# Altium project TrackerController.PrjPcb
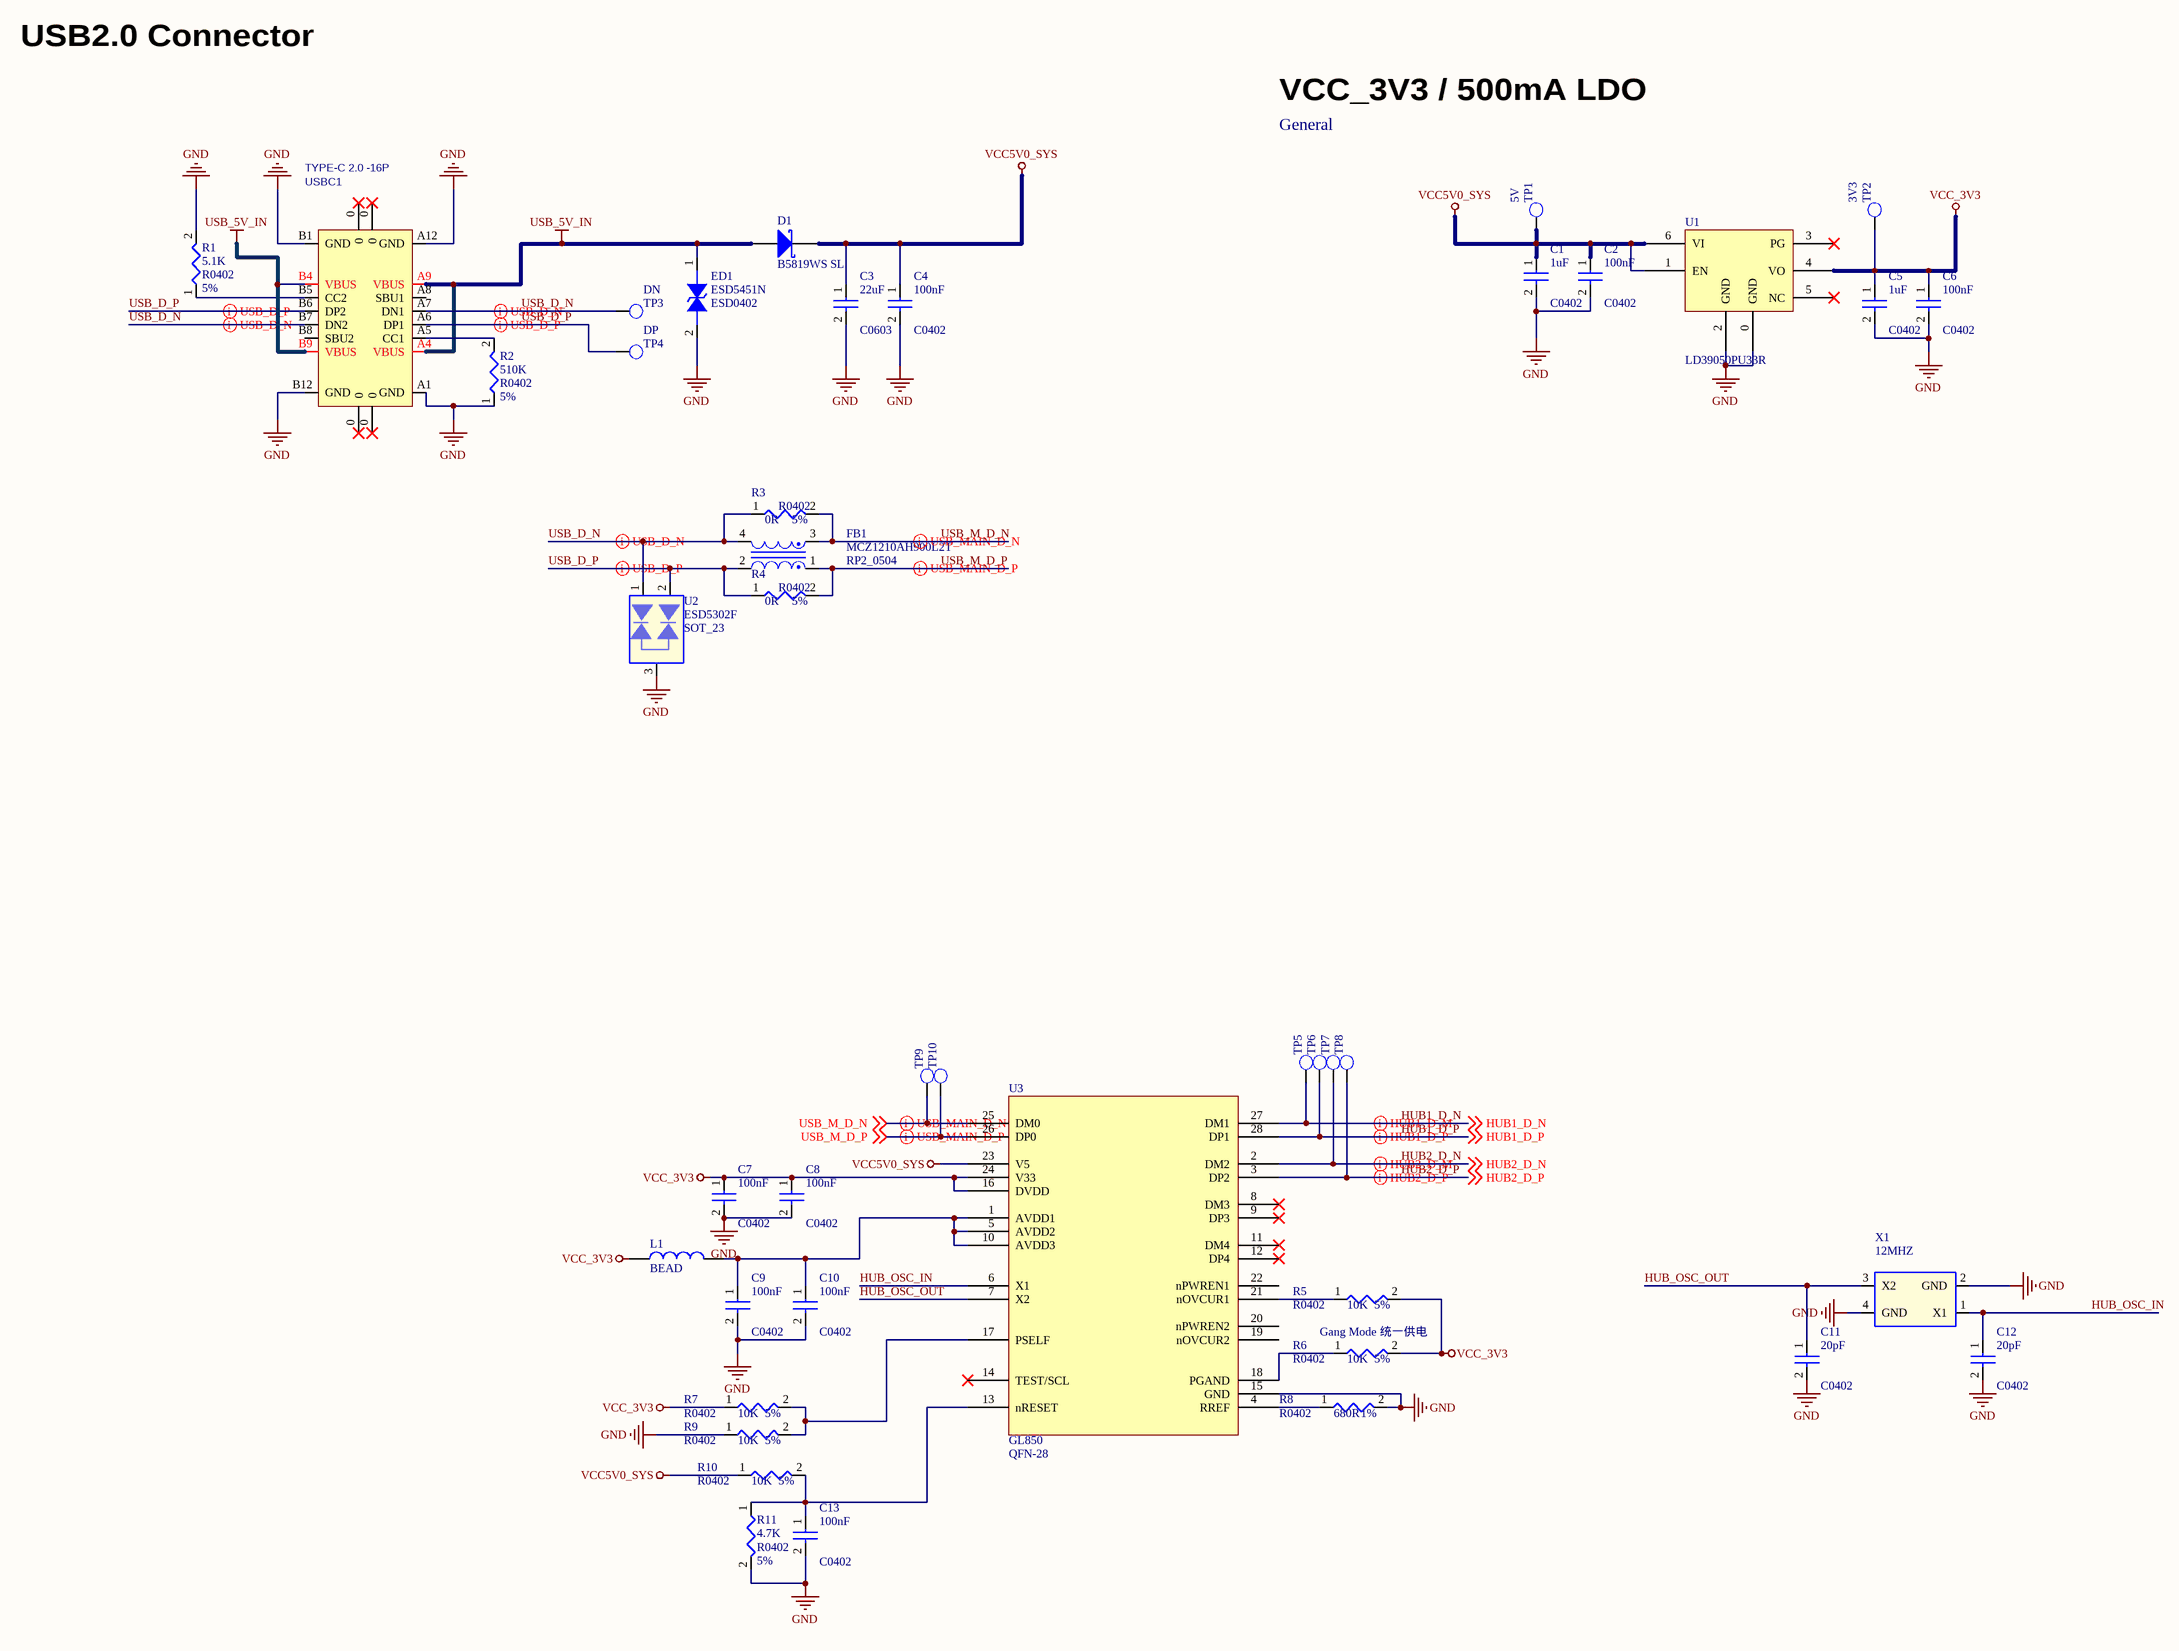
[diagram p0: 1.SchDoc]
3 sheets, 110 parts. Net scope: global (net labels, ports and power ports of the same name join across sheets).
Board file: tracker_controller.PcbDoc
Sheets:
  1.SchDoc
  2.SchDoc
  3.SchDoc

## Sheet 1.SchDoc
size C

### Parts
C1  1uF  PCB Footprint: C0402  [C0402_L]
C2  100nF  PCB Footprint: C0402  [C0402_L]
C3  22uF  PCB Footprint: C0603  [C0603_L]
C4  100nF  PCB Footprint: C0402  [C0402_L]
C5  1uF  PCB Footprint: C0402  [C0402_L]
C6  100nF  PCB Footprint: C0402  [C0402_L]
C7  100nF  PCB Footprint: C0402  [C0402_L]
C8  100nF  PCB Footprint: C0402  [C0402_L]
C9  100nF  PCB Footprint: C0402  [C0402_L]
C10  100nF  PCB Footprint: C0402  [C0402_L]
C11  20pF  PCB Footprint: C0402  [C0402_L]
C12  20pF  PCB Footprint: C0402  [C0402_L]
C13  100nF  PCB Footprint: C0402  [C0402_L]
D1  B5819WS SL  [SOD-323]
ED1  ESD5451N  [ESD0402]
FB1  MCZ1210AH900L2T  PCB Footprint: RP2_0504  [L0402D]  (net tie, no BOM)
L1  BEAD  [L0402]
R1  5.1K  Tolerance: 5%  [R0402]
R2  510K  Tolerance: 5%  [R0402]
R3  0R  Tolerance: 5%  [R0402]
R4  0R  Tolerance: 5%  [R0402]
R5  10K  Tolerance: 5%  [R0402]
R6  10K  Tolerance: 5%  [R0402]
R7  10K  Tolerance: 5%  [R0402]
R8  680R  Tolerance: 1%  [R0402]
R9  10K  Tolerance: 5%  [R0402]
R10  10K  Tolerance: 5%  [R0402]
R11  4.7K  Tolerance: 5%  [R0402]
TP1  5V  [TP_0R70]  (no BOM)
TP2  3V3  [TP_0R70]  (no BOM)
TP3  DN  [TP_0R70]  (no BOM)
TP4  DP  [TP_0R70]  (no BOM)
TP5  (no value)  [TP_0R70]  (no BOM)
TP6  (no value)  [TP_0R70]  (no BOM)
TP7  (no value)  [TP_0R70]  (no BOM)
TP8  (no value)  [TP_0R70]  (no BOM)
TP9  (no value)  [TP_0R70]  (no BOM)
TP10  (no value)  [TP_0R70]  (no BOM)
U1  LD39050PU33R  [SON95P300X300X100-7N]
U2  ESD5302F  PCB Footprint: SOT_23  [SOT23]
U3  GL850  [QFN-28]
USBC1  TYPE-C 2.0 -16P  [USB-C-SMD_16P]
X1  12MHZ  [XTAL_3225]

### Nets
GND: C1.2 C2.2 C3.2 C4.2 C5.2 C6.2 C7.2 C8.2 C9.2 C10.2 C11.2 C12.2 C13.2 ED1.2 R1.2 R2.1 R8.2 R9.1 R11.2 U1.0(GND) U1.2(GND) U2.3 U3.15(GND) USBC1.A1(GND) USBC1.A12(GND) USBC1.B1(GND) USBC1.B12(GND) X1.2(GND) X1.4(GND)  [project net AGND]
USB_5V_IN: D1.1(A) ED1.1 USBC1.A4(VBUS) USBC1.A9(VBUS) USBC1.B4(VBUS) USBC1.B9(VBUS)
VCC5V0_SYS: C1.1 C2.1 C3.1 C4.1 D1.2(K) R10.1 TP1.1 U1.1(EN) U1.6(VI) U3.23(V5)
VCC_3V3: C5.1 C6.1 C7.1 C8.1 L1.1 R5.2 R6.2 R7.1 TP2.1 U1.4(VO) U3.16(DVDD) U3.24(V33)
HUB1_D_N: TP5.1 U3.27(DM1) ; off-sheet HUB1_D_N
HUB1_D_P: TP6.1 U3.28(DP1) ; off-sheet HUB1_D_P
HUB2_D_N: TP7.1 U3.2(DM2) ; off-sheet HUB2_D_N
HUB2_D_P: TP8.1 U3.3(DP2) ; off-sheet HUB2_D_P
HUB_OSC_IN: C12.1 U3.6(X1) X1.1(X1)
HUB_OSC_OUT: C11.1 U3.7(X2) X1.3(X2)
USB_D_N: FB1.4 R3.1 TP3.1 U2.1 USBC1.A7(DN1) USBC1.B7(DN2)
USB_D_P: FB1.2 R4.1 TP4.1 U2.2 USBC1.A6(DP1) USBC1.B6(DP2)
USB_M_D_N: FB1.3 R3.2 TP9.1 U3.25(DM0) ; off-sheet USB_M_D_N
USB_M_D_P: FB1.1 R4.2 TP10.1 U3.26(DP0) ; off-sheet USB_M_D_P
NetC9_1: C9.1 C10.1 L1.2 U3.1(AVDD1) U3.5(AVDD2) U3.10(AVDD3)
NetC13_1: C13.1 R10.2 R11.1 U3.13(nRESET)
NetR1_1: R1.1 USBC1.B5(CC2)
NetR2_2: R2.2 USBC1.A5(CC1)
NetR5_1: R5.1 U3.21(nOVCUR1)
NetR6_1: R6.1 U3.18(PGAND)
NetR7_2: R7.2 R9.2 U3.17(PSELF)
NetR8_1: R8.1 U3.4(RREF)

Not connected (* = marked no-connect by the designer): U1 3(PG)* 5(NC)*; U3 8(DM3)* 9(DP3)* 11(DM4)* 12(DP4)* 14(TEST/SCL)* 19(nOVCUR2) 20(nPWREN2) 22(nPWREN1); USBC1 0* A8(SBU1) B8(SBU2)

### Layout directives
differential pair; differential pair class USB: HUB1_D_N, HUB1_D_P, HUB2_D_N, HUB2_D_P, USB_D_N, USB_D_P, USB_M_D_N, USB_M_D_P
differential pair; differential pair class USB; net class USB: USB_D_N, USB_D_P

### Notes on the sheet
- USB2.0 Connector
- VCC_3V3 / 500mA LDO
- General
- (near R6) Gang Mode 统一供电

### Library data of the parts
C1 C5 = CAP NP_Dup1: cap,1.0uF,+/-10%,6.3V,X5R,C0402; Manufacturer_Name: Open/Any; Priority: A; Part Type: Capacitor; Package: 0402; Manufacturer_Part_Number: Open/Any
C2 C6 = CAP NP_Dup1: cap,1.0uF,+/-10%,6.3V,C0402; Manufacturer_Name: Open/Any; Priority: A; Part Type: Capacitor; Package: 0402; Manufacturer_Part_Number: Open/Any
C3 = CAP NP_Dup1: cap,22.00uF,+/-10%,10V,X5R,C0603; Manufacturer_Name: Open/Any; Priority: A; Part Type: Capacitor; Package: 0603; Manufacturer_Part_Number: Open/Any
C4 C7-C10 C13 = CAP NP_Dup1: cap,100.00nF,+/-10%,10V,X5R,C0402; Manufacturer_Name: Open/Any; Priority: A; Part Type: Capacitor; Package: 0402; Manufacturer_Part_Number: Open/Any
C11 C12 = CAP NP_Dup1: cap,20pF,+/-10%,25V,X5R,C0402; Manufacturer_Name: Open/Any; Priority: A; Part Type: Capacitor; Package: 0402; Manufacturer_Part_Number: Open/Any
D1 = SS14: B5819WS SL 肖特基二极管 / SOD-323; Manufacturer_Name: MDD; Part Type: Diode; Package: SOD-323; Manufacturer_Part_Number: B5819WS SL
ED1 = DIODE BI_DIR TRIG: 1-Line, Bi-directional, Transient Voltage Suppressors.17.5pF.; Manufacturer_Name: Will Semiconductor Ltd.; Priority: A; PCB Footprint: ESD0402; Part Type: ESD_TVS; Manufacturer_Part_Number: ESD5451N; Package: 0402
FB1 = INDUCTOR COM: MCZ1210AH900L2T, 0603 90Ohm 100MHz; Manufacturer_Name: TDK; Priority: A; Part Type: BEAD; Manufacturer_Part_Number: MCZ1210AH900L2T; Package: 0504
L1 = L-AL: 鐵氧體磁珠 33ohm 0.55A 550mOhms 0402 Chip Bead; Manufacturer_Name: TDK; Manufacturer_Part_Number: MPZ0402S330CTF0W; PCB Footprint: 0402; Part Type: BEAD; Package: 0402
R1 = RESISTOR: 通用厚膜电阻,5.1K,+/-5%,R0402; Manufacturer_Name: Open/Any; Priority: A; PCB Footprint: R0402; Part Type: Resistor; Package: 0402; Manufacturer_Part_Number: Open/Any
R2 = RESISTOR: 通用厚膜电阻,510K,+/-1%,R0402; Manufacturer_Name: Open/Any; Priority: A; PCB Footprint: R0402; Part Type: Resistor; Package: 0402; Manufacturer_Part_Number: Open/Any
R3 R4 = RESISTOR: 通用厚膜电阻,0R,+/-5%,R0402; Manufacturer_Name: Open/Any; Priority: A; PCB Footprint: R0402; Part Type: Resistor; Package: 0402; Manufacturer_Part_Number: Open/Any
R5-R7 R9 R10 = RESISTOR: 通用厚膜电阻,10K,+/-5%,R0402; Manufacturer_Name: Open/Any; Priority: A; PCB Footprint: R0402; Part Type: Resistor; Package: 0402; Manufacturer_Part_Number: Open/Any
R8 = RESISTOR: 通用厚膜电阻,680R,+/-1%,R0402; Manufacturer_Name: Open/Any; Priority: A; PCB Footprint: R0402; Part Type: Resistor; Package: 0402; Manufacturer_Part_Number: Open/Any
R11 = RESISTOR: 通用厚膜电阻,4.7K,+/-5%,R0402; Manufacturer_Name: Open/Any; Priority: A; PCB Footprint: R0402; Part Type: Resistor; Package: 0402; Manufacturer_Part_Number: Open/Any
TP1-TP10 = TP: Test Point 0.7mm; PCB Footprint: TP_0R50; Priority: A; Part Type: TP
U1 = LD39050PU33R: LD39050PU33R / 6-DFN (3x3) / Output 500mA; Manufacturer_Name: STMicroelectronics; PCB Footprint: DFN-6; Manufacturer_Part_Number: LD39050PU33R; Package: DFN-6; Part Type: LDO
U2 = ESD_ESDA6V8UL: 2-Lines, Uni-directional,Ultra-low Capacitance.Transient Voltage Suppressors; Manufacturer_Name: Will Semiconductor Ltd.; Priority: A; Part Type: ESD_TVS; Manufacturer_Part_Number: ESD5302F; Package: SOT-23
U3 = GL850G: GL850 4 Port USB HUB QFN-28; Manufacturer_Name: Genesys Logic, Inc.; Manufacturer_Part_Number: GL850G-OHYXX; Package: QFN-28; Part Type: IC; PCB Footprint: QFN-28
USBC1 = USB2.0_Type-C_16Pin: USB2.0_Type-C_16Pin母座; Manufacturer_Name: SUNFUN/ Global Connector Technology; Manufacturer_Part_Number: MCCF-R1N1/USB4105-15-A-120; Part Type: USB Connector
X1 = CRYSTAL_4P: 12MHZ (16pF), 3.2 mm x 2.5 mm / 无源晶振(谐振器）; Manufacturer_Name: Open/Any; Manufacturer_Part_Number: Open/Any

## Sheet 2.SchDoc
size B
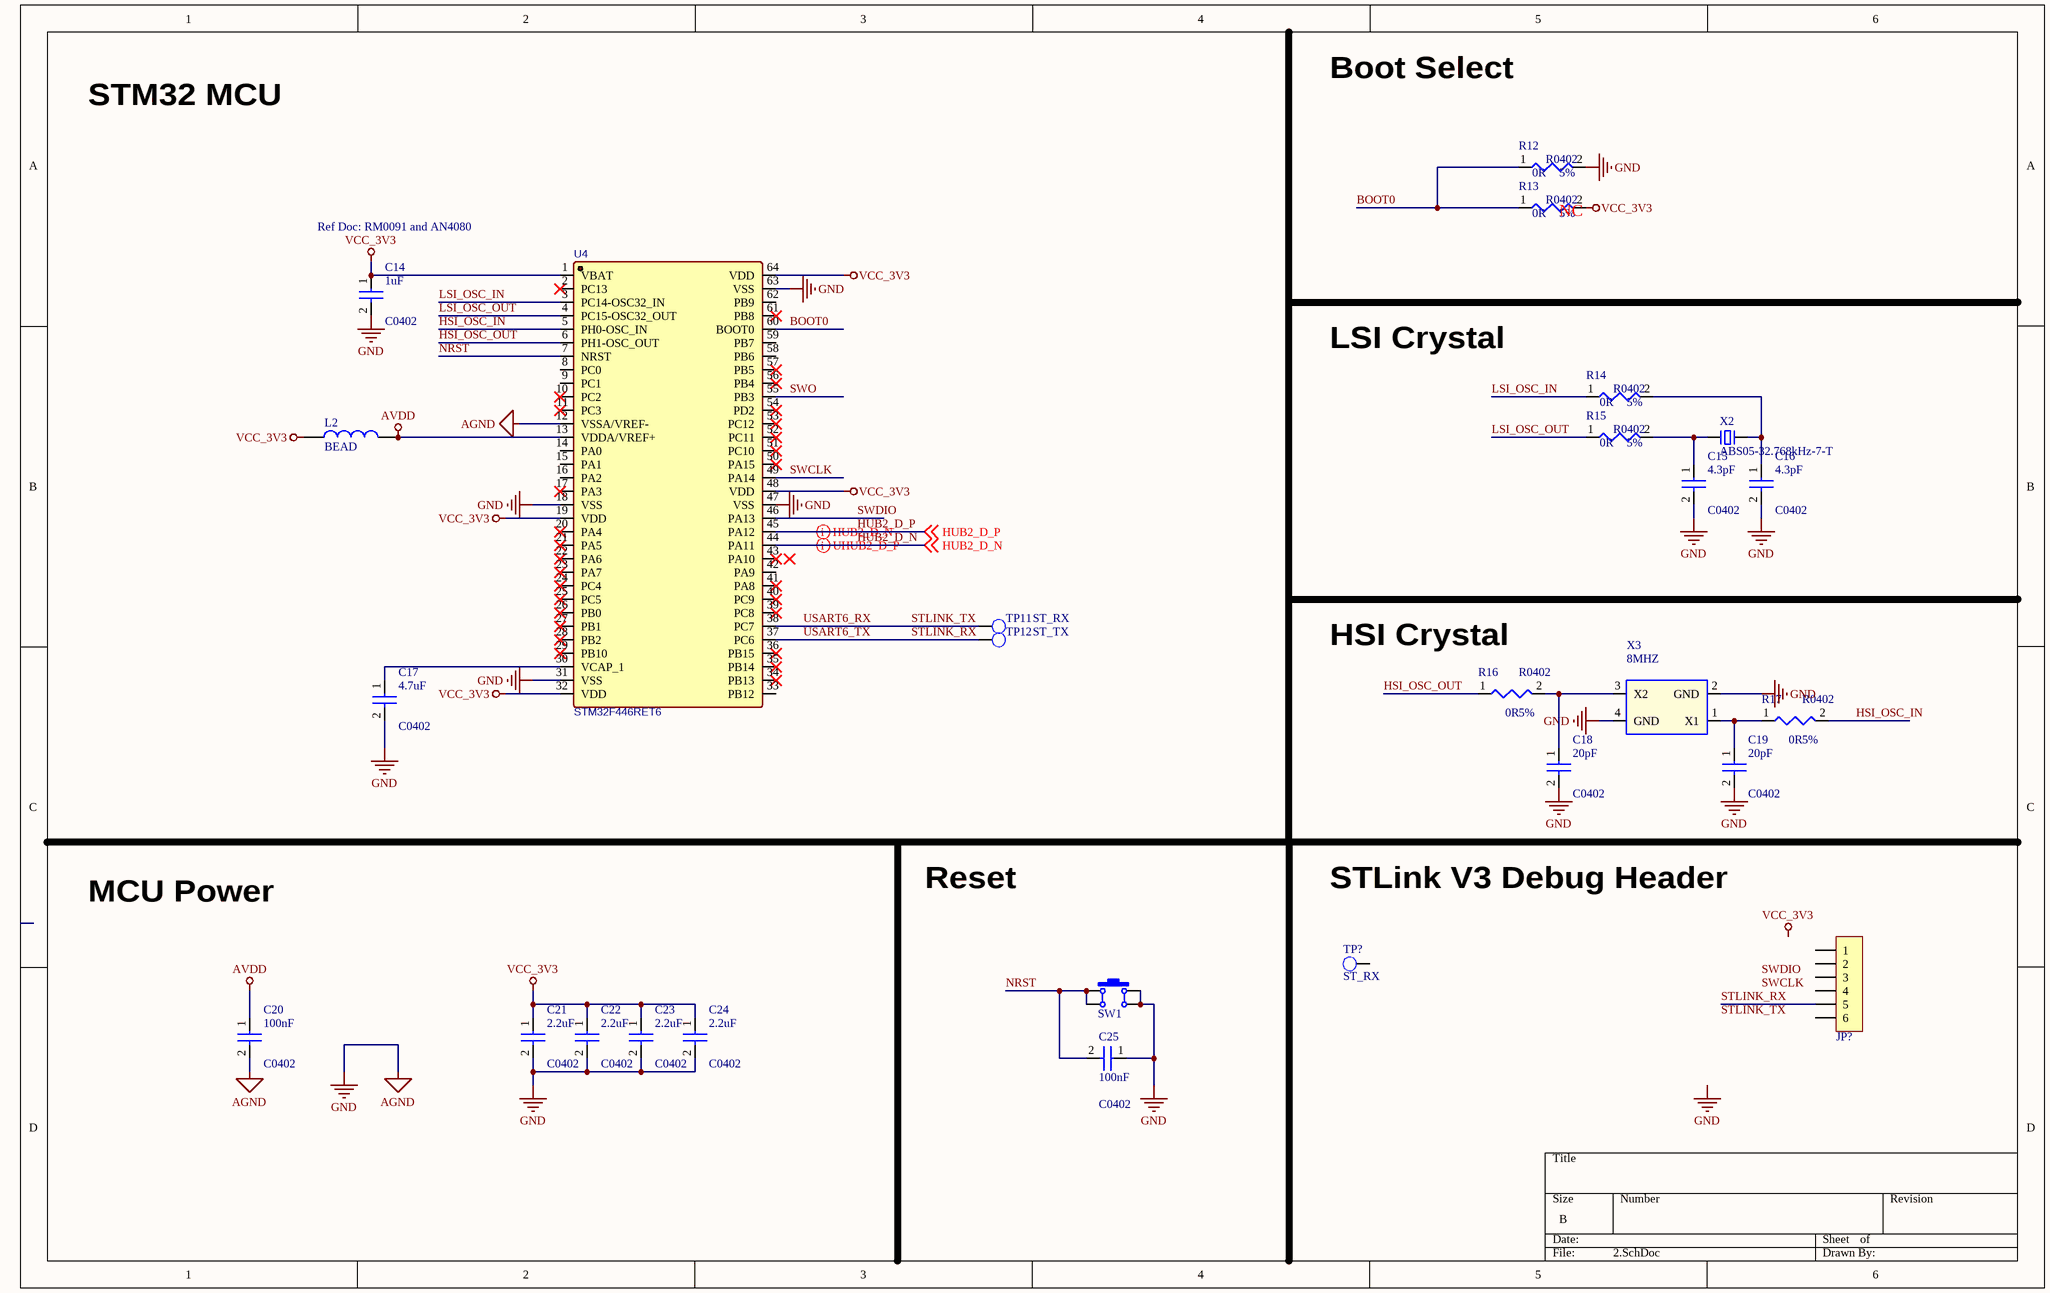
[diagram p1: 2.SchDoc]

### Parts
C14  1uF  PCB Footprint: C0402  [C0402_L]
C15  4.3pF  PCB Footprint: C0402  [C0402_L]
C16  4.3pF  PCB Footprint: C0402  [C0402_L]
C17  4.7uF  PCB Footprint: C0402  [C0402_L]
C18  20pF  PCB Footprint: C0402  [C0402_L]
C19  20pF  PCB Footprint: C0402  [C0402_L]
C20  100nF  PCB Footprint: C0402  [C0402_L]
C21  2.2uF  PCB Footprint: C0402  [C0402_L]
C22  2.2uF  PCB Footprint: C0402  [C0402_L]
C23  2.2uF  PCB Footprint: C0402  [C0402_L]
C24  2.2uF  PCB Footprint: C0402  [C0402_L]
C25  100nF  PCB Footprint: C0402  [C0402_L]
JP?  HDR-1X6  [HDR2.0-M-LI-6P]  (value not drawn)
L2  BEAD  [L0402]
R12  0R  Tolerance: 5%  [R0402]
R13  0R  Tolerance: 5%  [R0402]  (net tie, no BOM)
R14  0R  Tolerance: 5%  [R0402]
R15  0R  Tolerance: 5%  [R0402]
R16  0R  Tolerance: 5%  [R0402]
R17  0R  Tolerance: 5%  [R0402]
SW1  6x6x1.5  [TSW SMD-6*6*5]  (value not drawn)
TP11  ST_RX  [TP_0R70]  (no BOM)
TP12  ST_TX  [TP_0R70]  (no BOM)
TP?  ST_RX  [TP_0R70]  (no BOM)
U4  STM32F446RET6  [LQFP64_L]
X2  ABS05-32.768kHz-7-T  [XTAL_3215]
X3  8MHZ  [XTAL_3225]

### Nets
AGND: C14.2 C15.2 C16.2 C17.2 C18.2 C19.2 C20.2 C21.2 C22.2 C23.2 C24.2 C25.1 R12.2 SW1.2 SW1.3 U4.12(VSSA/VREF-) U4.18(VSS) U4.31(VSS) U4.47(VSS) U4.63(VSS) X3.2(GND) X3.4(GND)  [also labelled GND]
AVDD: C20.1 L2.2 U4.13(VDDA/VREF+)
VCC_3V3: C14.1 C21.1 C22.1 C23.1 C24.1 L2.1 R13.2 U4.1(VBAT) U4.19(VDD) U4.32(VDD) U4.48(VDD) U4.64(VDD)
BOOT0: R12.1 R13.1 U4.60(BOOT0)
HSI_OSC_IN: R17.2 U4.5(PH0-OSC_IN)
HSI_OSC_OUT: R16.1 U4.6(PH1-OSC_OUT)
HUB2_D_N: U4.44(PA11) ; off-sheet HUB2_D_N
HUB2_D_P: U4.45(PA12) ; off-sheet HUB2_D_P
LSI_OSC_IN: R14.1 U4.3(PC14-OSC32_IN)
LSI_OSC_OUT: R15.1 U4.4(PC15-OSC32_OUT)
NRST: C25.2 SW1.1 SW1.4 U4.7(NRST)
STLINK_RX: JP?.5 TP12.1 U4.37(PC6)  [also labelled USART6_TX]
STLINK_TX: TP11.1 U4.38(PC7)  [also labelled USART6_RX]
SWCLK: U4.49(PA14)
SWDIO: U4.46(PA13)
SWO: U4.55(PB3)
NetC15_1: C15.1 R15.2 X2.1
NetC16_1: C16.1 R14.2 X2.2
NetC17_1: C17.1 U4.30(VCAP_1)
NetC18_1: C18.1 R16.2 X3.3(X2)
NetC19_1: C19.1 R17.1 X3.1(X1)

Not connected (* = marked no-connect by the designer): JP? 1 2 3 4 6; TP? 1; U4 2(PC13)* 8(PC0) 9(PC1) 10(PC2)* 11(PC3)* 14(PA0) 15(PA1) 16(PA2) 17(PA3)* 20(PA4)* 21(PA5)* 22(PA6)* 23(PA7)* 24(PC4)* 25(PC5)* 26(PB0)* 27(PB1)* 28(PB2)* 29(PB10)* 33(PB12) 34(PB13)* 35(PB14)* 36(PB15)* 39(PC8)* 40(PC9)* 41(PA8)* 42(PA9) 43(PA10)* 50(PA15)* 51(PC10)* 52(PC11)* 53(PC12)* 54(PD2)* 56(PB4)* 57(PB5)* 58(PB6) 59(PB7) 61(PB8)* 62(PB9)

### Layout directives
differential pair; differential pair class USB: HUB2_D_N, HUB2_D_P

### Notes on the sheet
- Boot Select
- STM32 MCU
- Ref Doc: RM0091 and AN4080
- (near R13) NC
- LSI Crystal
- (near R16) HSI Crystal
- MCU Power
- Reset
- STLink V3 Debug Header
- Labels drawn without touching a wire or pin: GND, SWCLK, SWDIO, VCC_3V3

### Library data of the parts
C14 = CAP NP_Dup1: cap,1.00uF,+/-10%,10V,X5R,C0402; Manufacturer_Name: Open/Any; Priority: A; Part Type: Capacitor; Package: 0402; Manufacturer_Part_Number: Open/Any
C15 C16 = CAP NP_Dup1: cap,4.3pF,+/-10%,25V,X5R,C0402; Manufacturer_Name: Open/Any; Priority: A; Part Type: Capacitor; Package: 0402; Manufacturer_Part_Number: Open/Any
C17 = CAP NP_Dup1: cap,4.70uF,+/-10%,6.3V,X5R,C0402; Manufacturer_Name: Open/Any; Priority: A; Part Type: Capacitor; Package: 0402; Manufacturer_Part_Number: Open/Any
C18 C19 = CAP NP_Dup1: as C11 on sheet 1; Part Type: Capacitor; Package: 0402; Manufacturer_Part_Number: Open/Any
C20 C25 = CAP NP_Dup1: as C4 on sheet 1; Part Type: Capacitor; Package: 0402; Manufacturer_Part_Number: Open/Any
C21-C24 = CAP NP_Dup1: cap,2.20uF,+/-10%,10V,X5R,C0402; Manufacturer_Name: Open/Any; Priority: A; Part Type: Capacitor; Package: 0402; Manufacturer_Part_Number: Open/Any
JP? = Header 6: 6P接插件; 封装库来自淘宝卖家 ID：黄晶宝石: https://shop463601444.taobao.com
L2 = L-AL: as L1 on sheet 1; Part Type: BEAD; Package: 0402
R12-R17 = RESISTOR: as R3 on sheet 1; PCB Footprint: R0402; Part Type: Resistor; Package: 0402; Manufacturer_Part_Number: Open/Any
SW1 = SW SMD-4x4: 贴片6x6x1.5 轻触开关; Part Type: Mount Hole
TP11 TP12 TP? = TP: as TP1 on sheet 1; Part Type: TP
U4 = STM32F446RET6: Manufacturer_Name: STMicroelectronics; PCB Footprint: LQFP64; Package: LQFP64; Part Type: Microcontroller; Manufacturer_Part_Number: STM32F446RE
X2 = XTAL-2P: ABS05-32.768kHz-7-T / 3215 2脚无源晶振(谐振器）; Manufacturer_Name: Open/Any; Manufacturer_Part_Number: Open/Any
X3 = CRYSTAL_4P: 8MHZ (16pF), 3.2 mm x 2.5 mm / 无源晶振(谐振器）; Manufacturer_Name: Open/Any; Manufacturer_Part_Number: Open/Any

## Sheet 3.SchDoc
size A
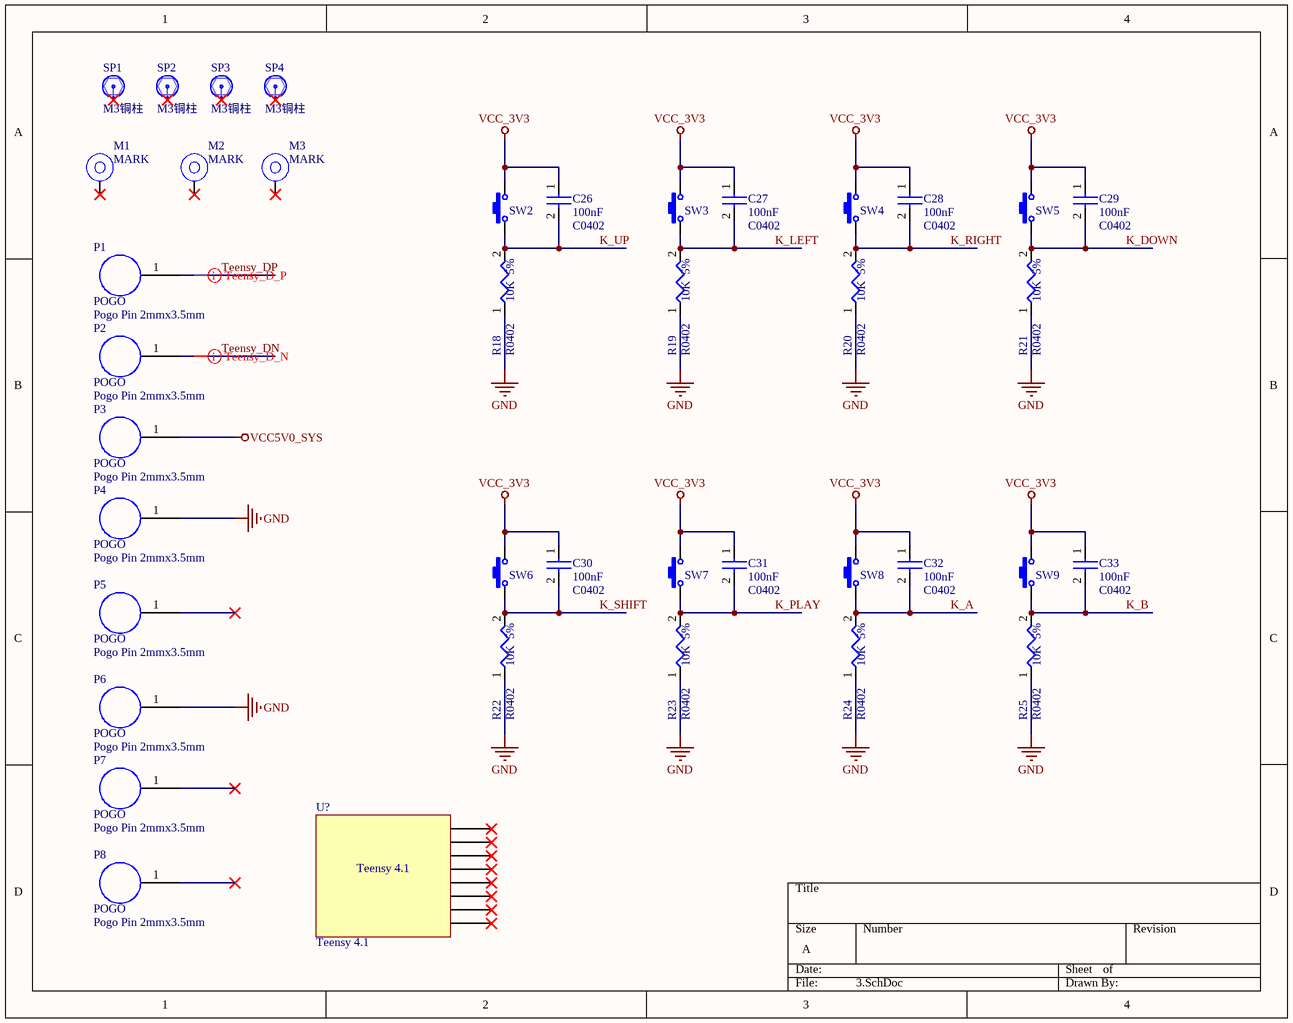
[diagram p2: 3.SchDoc]

### Parts
C26  100nF  PCB Footprint: C0402  [C0402_L]
C27  100nF  PCB Footprint: C0402  [C0402_L]
C28  100nF  PCB Footprint: C0402  [C0402_L]
C29  100nF  PCB Footprint: C0402  [C0402_L]
C30  100nF  PCB Footprint: C0402  [C0402_L]
C31  100nF  PCB Footprint: C0402  [C0402_L]
C32  100nF  PCB Footprint: C0402  [C0402_L]
C33  100nF  PCB Footprint: C0402  [C0402_L]
M1  MARK  [MARK]  (net tie, no BOM)
M2  MARK  [MARK]  (net tie, no BOM)
M3  MARK  [MARK]  (net tie, no BOM)
P1  Pogo Pin 2mmx3.5mm  [Pogo_2x3.5]
P2  Pogo Pin 2mmx3.5mm  [Pogo_2x3.5]
P3  Pogo Pin 2mmx3.5mm  [Pogo_2x3.5]
P4  Pogo Pin 2mmx3.5mm  [Pogo_2x3.5]
P5  Pogo Pin 2mmx3.5mm  [Pogo_2x3.5]
P6  Pogo Pin 2mmx3.5mm  [Pogo_2x3.5]
P7  Pogo Pin 2mmx3.5mm  [Pogo_2x3.5]
P8  Pogo Pin 2mmx3.5mm  [Pogo_2x3.5]
R18  10K  Tolerance: 5%  [R0402]
R19  10K  Tolerance: 5%  [R0402]
R20  10K  Tolerance: 5%  [R0402]
R21  10K  Tolerance: 5%  [R0402]
R22  10K  Tolerance: 5%  [R0402]
R23  10K  Tolerance: 5%  [R0402]
R24  10K  Tolerance: 5%  [R0402]
R25  10K  Tolerance: 5%  [R0402]
SP1  M3铜柱  [M3x4_N]  (net tie, no BOM)
SP2  M3铜柱  [M3x4_N]  (net tie, no BOM)
SP3  M3铜柱  [M3x4_N]  (net tie, no BOM)
SP4  M3铜柱  [M3x4_N]  (net tie, no BOM)
SW2  3x6x5  [Kailh_socket_PG1350]  (value not drawn)
SW3  3x6x5  [Kailh_socket_PG1350]  (value not drawn)
SW4  3x6x5  [Kailh_socket_PG1350]  (value not drawn)
SW5  3x6x5  [Kailh_socket_PG1350]  (value not drawn)
SW6  3x6x5  [Kailh_socket_PG1350]  (value not drawn)
SW7  3x6x5  [Kailh_socket_PG1350]  (value not drawn)
SW8  3x6x5  [Kailh_socket_PG1350]  (value not drawn)
SW9  3x6x5  [Kailh_socket_PG1350]  (value not drawn)
U?  Teensy 4.1  [Teensy_Mech]  (net tie)

### Nets
GND: P4.1 P6.1 R18.1 R19.1 R20.1 R21.1 R22.1 R23.1 R24.1 R25.1  [project net AGND]
VCC5V0_SYS: P3.1
VCC_3V3: C26.1 C27.1 C28.1 C29.1 C30.1 C31.1 C32.1 C33.1 SW2.2 SW3.2 SW4.2 SW5.2 SW6.2 SW7.2 SW8.2 SW9.2
K_A: C32.2 R24.2 SW8.1
K_B: C33.2 R25.2 SW9.1
K_DOWN: C29.2 R21.2 SW5.1
K_LEFT: C27.2 R19.2 SW3.1
K_PLAY: C31.2 R23.2 SW7.1
K_RIGHT: C28.2 R20.2 SW4.1
K_SHIFT: C30.2 R22.2 SW6.1
K_UP: C26.2 R18.2 SW2.1
Teensy_DN: P2.1
Teensy_DP: P1.1

Not connected (* = marked no-connect by the designer): M1 1*; M2 1*; M3 1*; P5 1*; P7 1*; P8 1*; SP1 1*; SP2 1*; SP3 1*; SP4 1*; U? ?1* ?2* ?3* ?4* ?5* ?6* ?7* ?8*

### Layout directives
differential pair; differential pair class USB; net class USB: Teensy_DN, Teensy_DP

### Notes on the sheet
- (in symbol Pogo Pin) POGO

### Library data of the parts
C26-C33 = CAP NP_Dup1: as C4 on sheet 1; Part Type: Capacitor; Package: 0402; Manufacturer_Part_Number: Open/Any
M1-M3 = MARK: PCBA MARKS; Part Type: Mechnical
P1-P8 = Pogo Pin
R18-R25 = RESISTOR: as R5 on sheet 1; PCB Footprint: R0402; Part Type: Resistor; Package: 0402; Manufacturer_Part_Number: Open/Any
SP1-SP4 = 铜柱大焊盘: 铜柱; Part Type: Mount Hole
SW2-SW9 = SW-PB: 微动开关; BOM名称: 3x6轻触开关; 联系卖家，免费查找封装: 唯一出售店铺网址https://shop463601444.taobao.com; 封装库来自淘宝卖家ID：黄晶宝石: 其他店铺购入均为盗版假冒封装库，请立即申请退款

## Nets that join several sheets
AGND: 1 (29 pins), 2 (22 pins), 3 (10 pins)
VCC5V0_SYS: 1 (10 pins), 3 (P3.1)
VCC_3V3: 1 (12 pins), 2 (12 pins), 3 (16 pins)
HUB2_D_N: 1 (TP7.1 U3.2), 2 (U4.44)
HUB2_D_P: 1 (TP8.1 U3.3), 2 (U4.45)